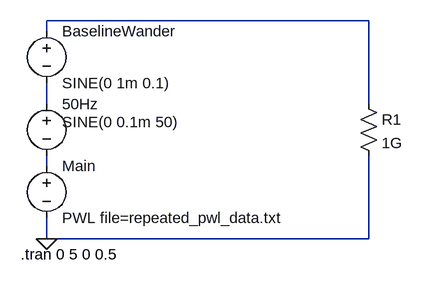
[diagram p0: schematic ECG simulation.asc]
ECG simulation.asc, the LTspice schematic file:
Version 4
SHEET 1 880 680
WIRE 592 -16 96 -16
WIRE 96 0 96 -16
WIRE 96 112 96 80
WIRE 592 112 592 -16
WIRE 96 208 96 192
WIRE 96 320 96 288
WIRE 592 320 592 192
WIRE 592 320 96 320
FLAG 96 320 0
SYMBOL voltage 96 96 R0
WINDOW 3 24 44 Left 2
WINDOW 123 0 0 Left 0
WINDOW 39 0 0 Left 0
SYMATTR InstName 50Hz
SYMATTR Value SINE(0 0.1m 50)
SYMBOL res 576 96 R0
SYMATTR InstName R1
SYMATTR Value 1G
SYMBOL voltage 96 -16 R0
WINDOW 123 0 0 Left 0
WINDOW 39 0 0 Left 0
SYMATTR InstName BaselineWander
SYMATTR Value SINE(0 1m 0.1)
SYMBOL voltage 96 192 R0
WINDOW 123 0 0 Left 0
WINDOW 39 0 0 Left 0
SYMATTR InstName Main
SYMATTR Value PWL file=repeated_pwl_data.txt
TEXT 56 344 Left 2 !.tran 0 5 0 0.5

The netlist it stands for:
* ECG simulation.asc
V§50Hz N002 N003 SINE(0 0.1m 50)
R1 N001 0 1G
V§BaselineWander N001 N002 SINE(0 1m 0.1)
V§Main N003 0 PWL file=repeated_pwl_data.txt
.tran 0 5 0 0.5
.backanno
.end